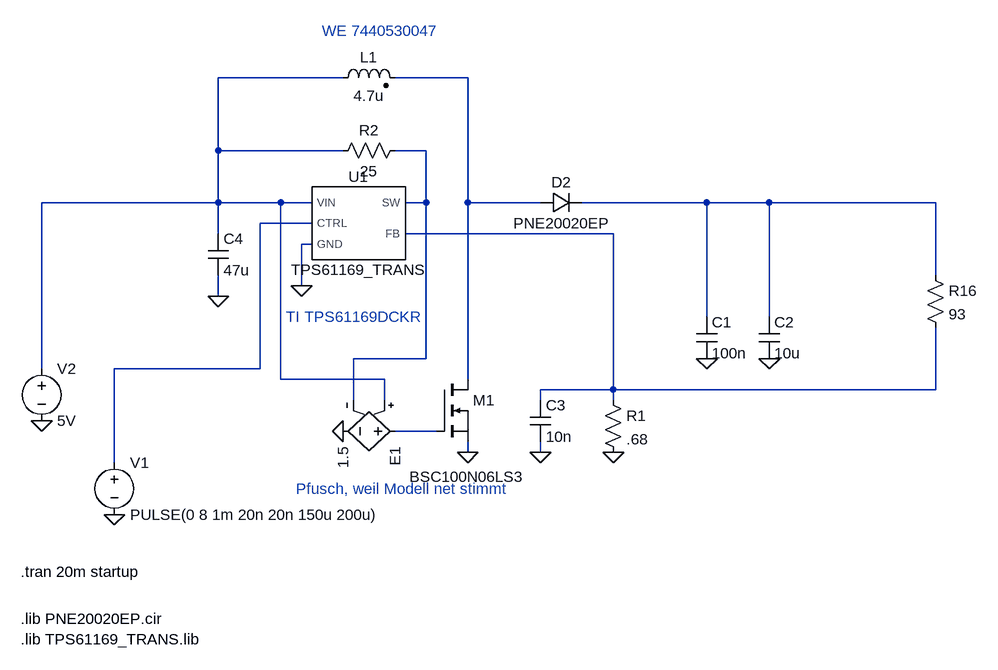
[diagram p0: schematic Konstantstromquelle 300mA.asc]
Konstantstromquelle 300mA.asc, the LTspice schematic file:
Version 4
SHEET 1 2224 1392
WIRE 64 32 -128 32
WIRE 256 32 144 32
WIRE -128 144 -128 32
WIRE 64 144 -128 144
WIRE 192 144 144 144
WIRE -128 224 -128 144
WIRE -128 224 -400 224
WIRE -32 224 -128 224
WIRE 16 224 -32 224
WIRE 192 224 192 144
WIRE 192 224 160 224
WIRE 256 224 256 32
WIRE 368 224 256 224
WIRE 624 224 432 224
WIRE 720 224 624 224
WIRE 976 224 720 224
WIRE 16 256 -64 256
WIRE -128 272 -128 224
WIRE 480 272 160 272
WIRE 16 288 0 288
WIRE 976 336 976 224
WIRE 0 352 0 288
WIRE -128 368 -128 336
WIRE 624 400 624 224
WIRE 720 400 720 224
WIRE 192 464 192 224
WIRE 192 464 80 464
WIRE -400 480 -400 224
WIRE -64 480 -64 256
WIRE -64 480 -288 480
WIRE -32 496 -32 224
WIRE 128 496 -32 496
WIRE 256 496 256 224
WIRE 480 512 480 272
WIRE 480 512 368 512
WIRE 976 512 976 416
WIRE 976 512 480 512
WIRE 80 528 80 464
WIRE 128 528 128 496
WIRE 368 528 368 512
WIRE 480 528 480 512
WIRE 208 576 144 576
WIRE 256 608 256 592
WIRE 368 608 368 592
WIRE -288 624 -288 480
FLAG 624 464 0
FLAG 720 464 0
FLAG 480 608 0
FLAG -400 560 0
FLAG -128 368 0
FLAG 0 352 0
FLAG 368 608 0
FLAG -288 704 0
FLAG 256 608 0
FLAG 64 576 0
SYMBOL ind2 48 48 R270
WINDOW 0 32 56 VTop 2
WINDOW 3 4 56 VBottom 2
SYMATTR InstName L1
SYMATTR Value 4.7u
SYMATTR Type ind
SYMATTR SpiceLine Ipk=1.9 Rser=120m Cpar=250p
SYMBOL cap 608 400 R0
SYMATTR InstName C1
SYMATTR Value 100n
SYMBOL cap 704 400 R0
SYMATTR InstName C2
SYMATTR Value 10u
SYMBOL res 464 512 R0
SYMATTR InstName R1
SYMATTR Value .68
SYMBOL voltage -400 464 R0
WINDOW 123 0 0 Left 0
WINDOW 39 0 0 Left 0
SYMATTR InstName V2
SYMATTR Value 5V
SYMBOL diode 368 240 R270
WINDOW 0 32 32 VTop 2
WINDOW 3 0 32 VBottom 2
SYMATTR InstName D2
SYMATTR Value PNE20020EP
SYMATTR Prefix X
SYMBOL cap -144 272 R0
SYMATTR InstName C4
SYMATTR Value 47u
SYMBOL res 960 320 R0
SYMATTR InstName R16
SYMATTR Value 93
SYMBOL TPS61169_TRANS 80 256 R0
SYMATTR InstName U1
SYMATTR Prefix X
SYMATTR Value TPS61169_TRANS
SYMBOL cap 352 528 R0
SYMATTR InstName C3
SYMATTR Value 10n
SYMBOL voltage -288 608 R0
WINDOW 123 0 0 Left 0
WINDOW 39 0 0 Left 0
SYMATTR InstName V1
SYMATTR Value PULSE(0 8 1m 20n 20n 150u 200u)
SYMBOL nmos 208 496 R0
WINDOW 3 -42 150 Left 2
SYMATTR InstName M1
SYMATTR Value BSC100N06LS3
SYMBOL e 160 576 R90
SYMATTR InstName E1
SYMATTR Value 1.5
SYMBOL res 160 128 R90
WINDOW 0 0 56 VBottom 2
WINDOW 3 32 56 VTop 2
SYMATTR InstName R2
SYMATTR Value 25
TEXT -432 864 Left 2 !.lib PNE20020EP.cir
TEXT -432 896 Left 2 !.lib TPS61169_TRANS.lib
TEXT -432 792 Left 2 !.tran 20m startup
TEXT 32 -40 Left 2 ;WE 7440530047
TEXT -24 400 Left 2 ;TI TPS61169DCKR
TEXT -8 664 Left 2 ;Pfusch, weil Modell net stimmt

The netlist it stands for:
* Konstantstromquelle 300mA.asc
L1 N001 N002 4.7u Ipk=1.9 Rser=120m Cpar=250p
C1 N004 0 100n
C2 N004 0 10u
R1 N006 0 .68
V2 N001 0 5V
XD2 N002 N004 PNE20020EP  ; pins + -
C4 N001 0 47u
R16 N004 N006 93
XU1 N005 N006 0 N003 N001 TPS61169_TRANS  ; pins CTRL FB GND SW VIN
C3 N006 0 10n
V1 N005 0 PULSE(0 8 1m 20n 20n 150u 200u)
M1 N002 N007 0 0 BSC100N06LS3
E1 N007 0 N001 N003 1.5
R2 N003 N001 25
.model NMOS NMOS
.model PMOS PMOS
.lib standard.mos
.lib PNE20020EP.cir
.lib TPS61169_TRANS.lib
.tran 20m startup
* WE 7440530047
* TI TPS61169DCKR
* Pfusch, weil Modell net stimmt
.lib C:\Git\TubeTester\simulation\TPS61169_TRANS.lib
.backanno
.end